# EAGLE design Cheer_Dev_Kit (EAGLE 9.4.2)
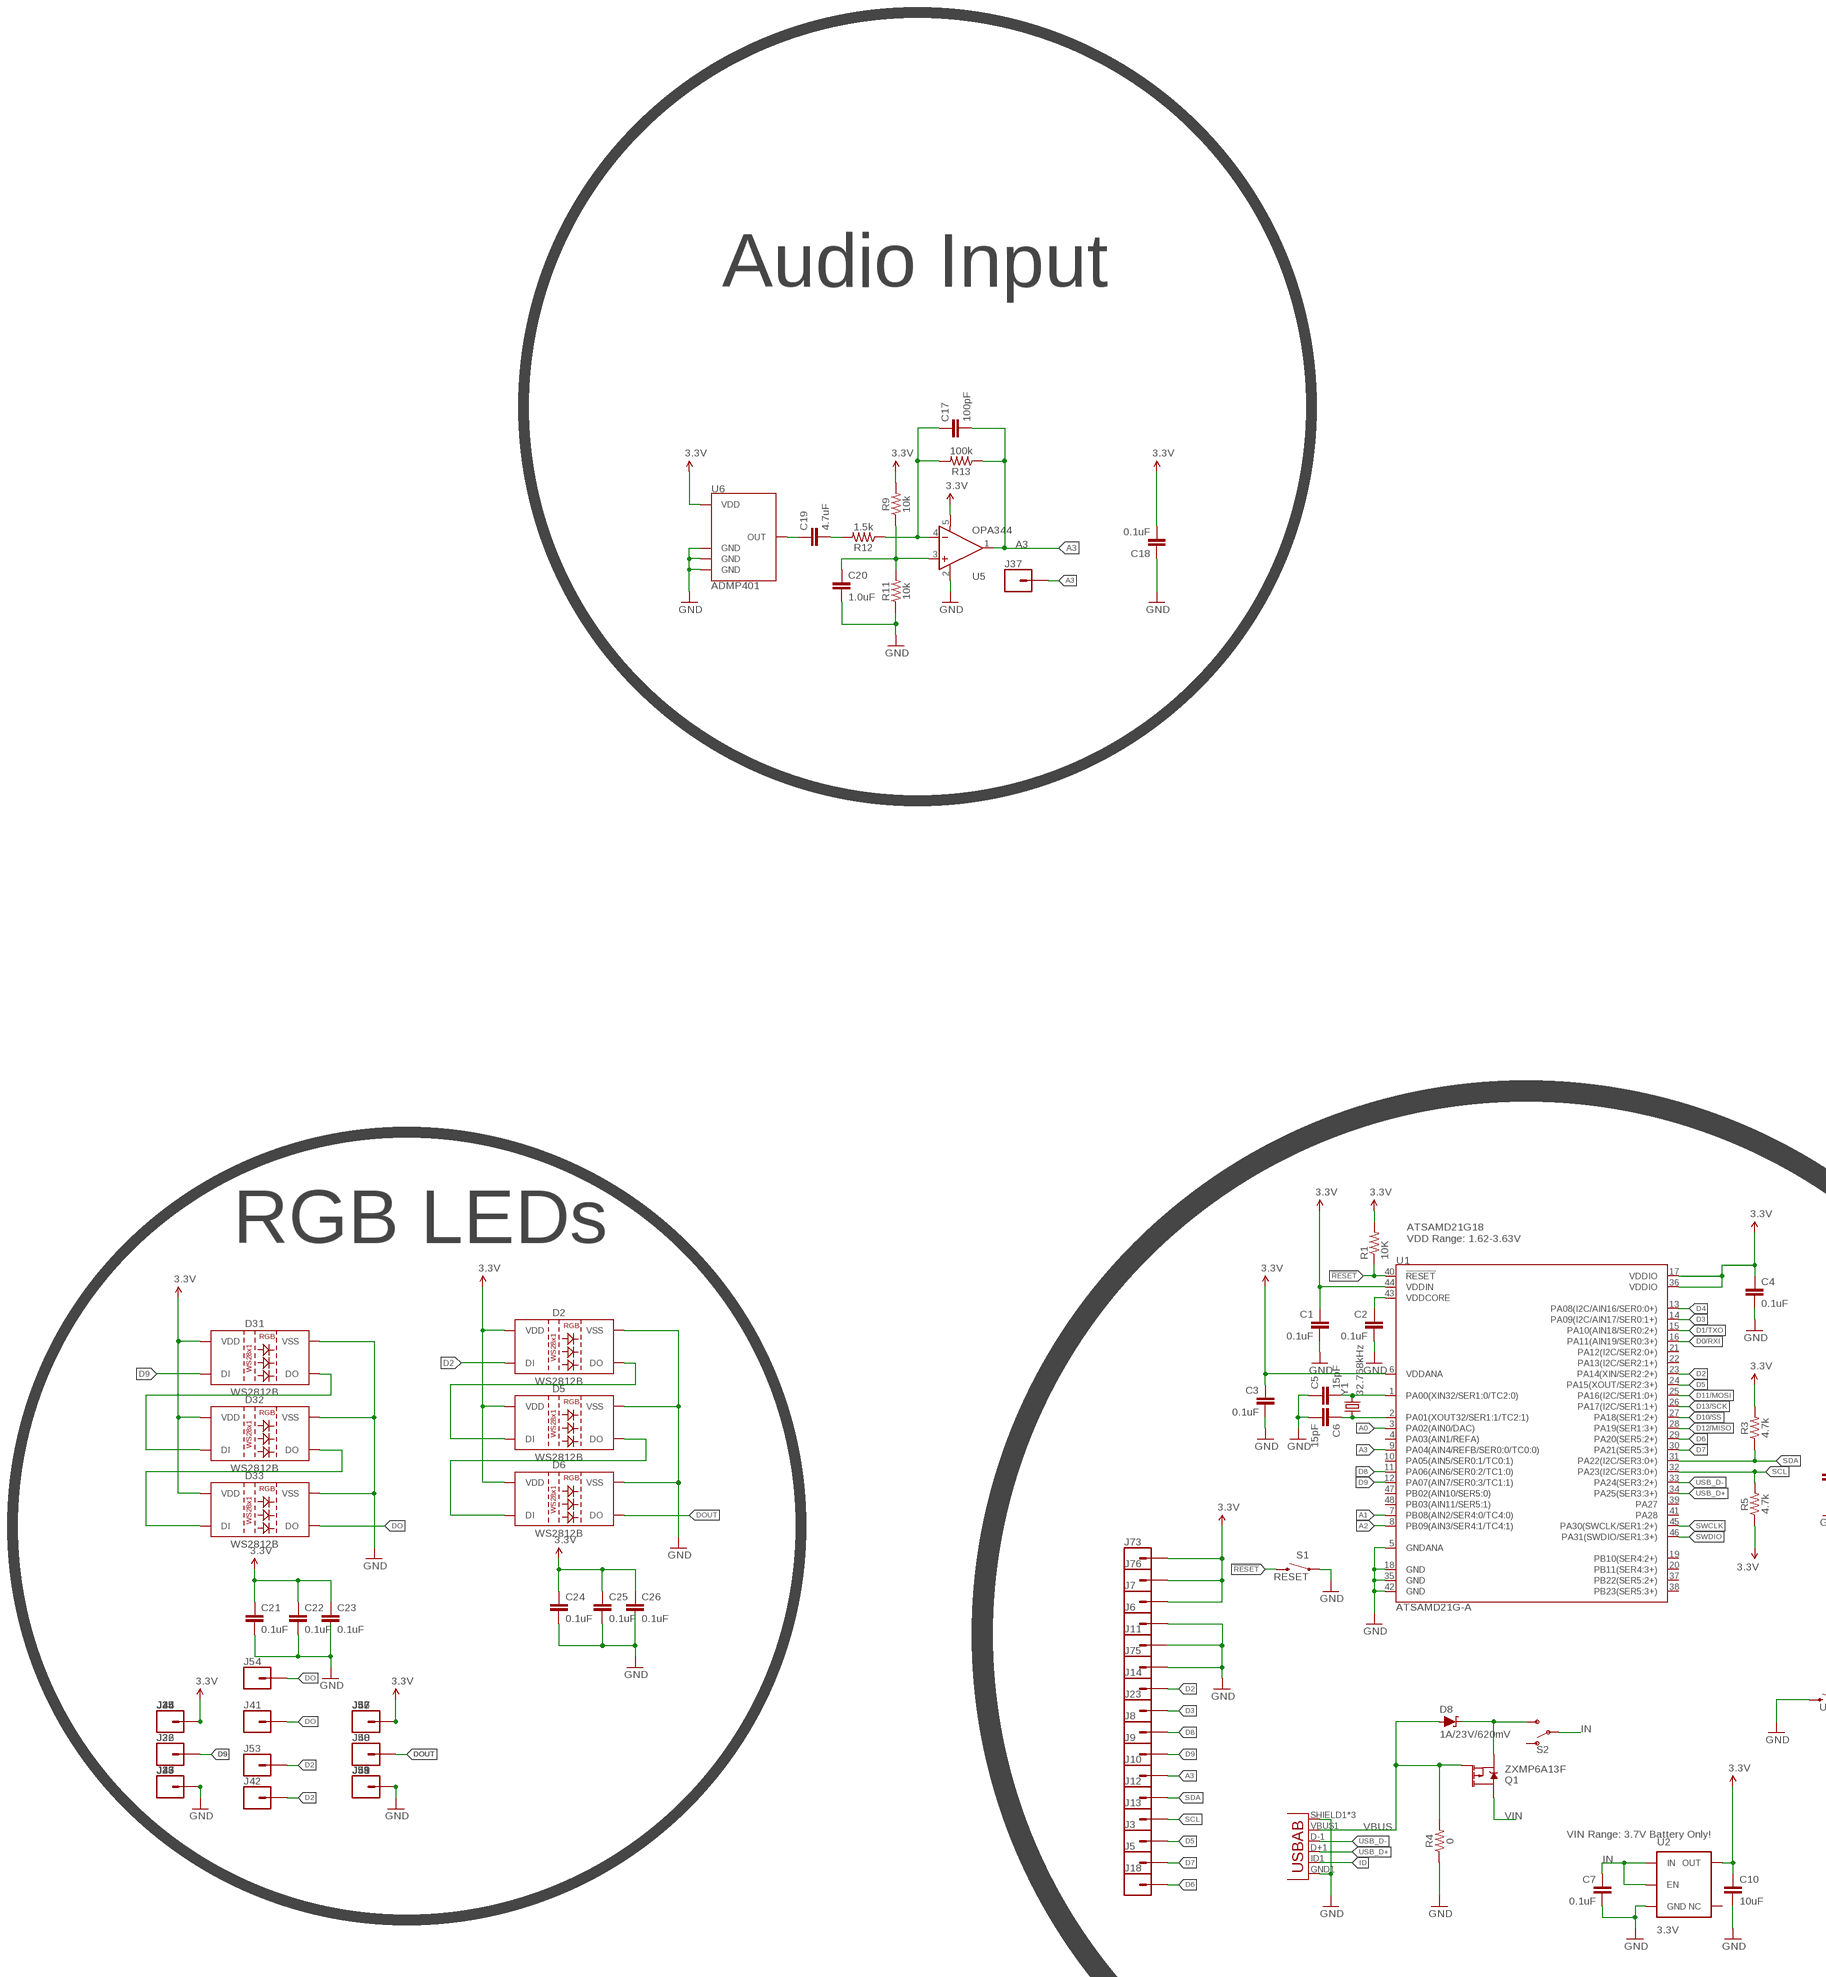
[diagram p0: schematic, sheet 1, part 1 of 3]
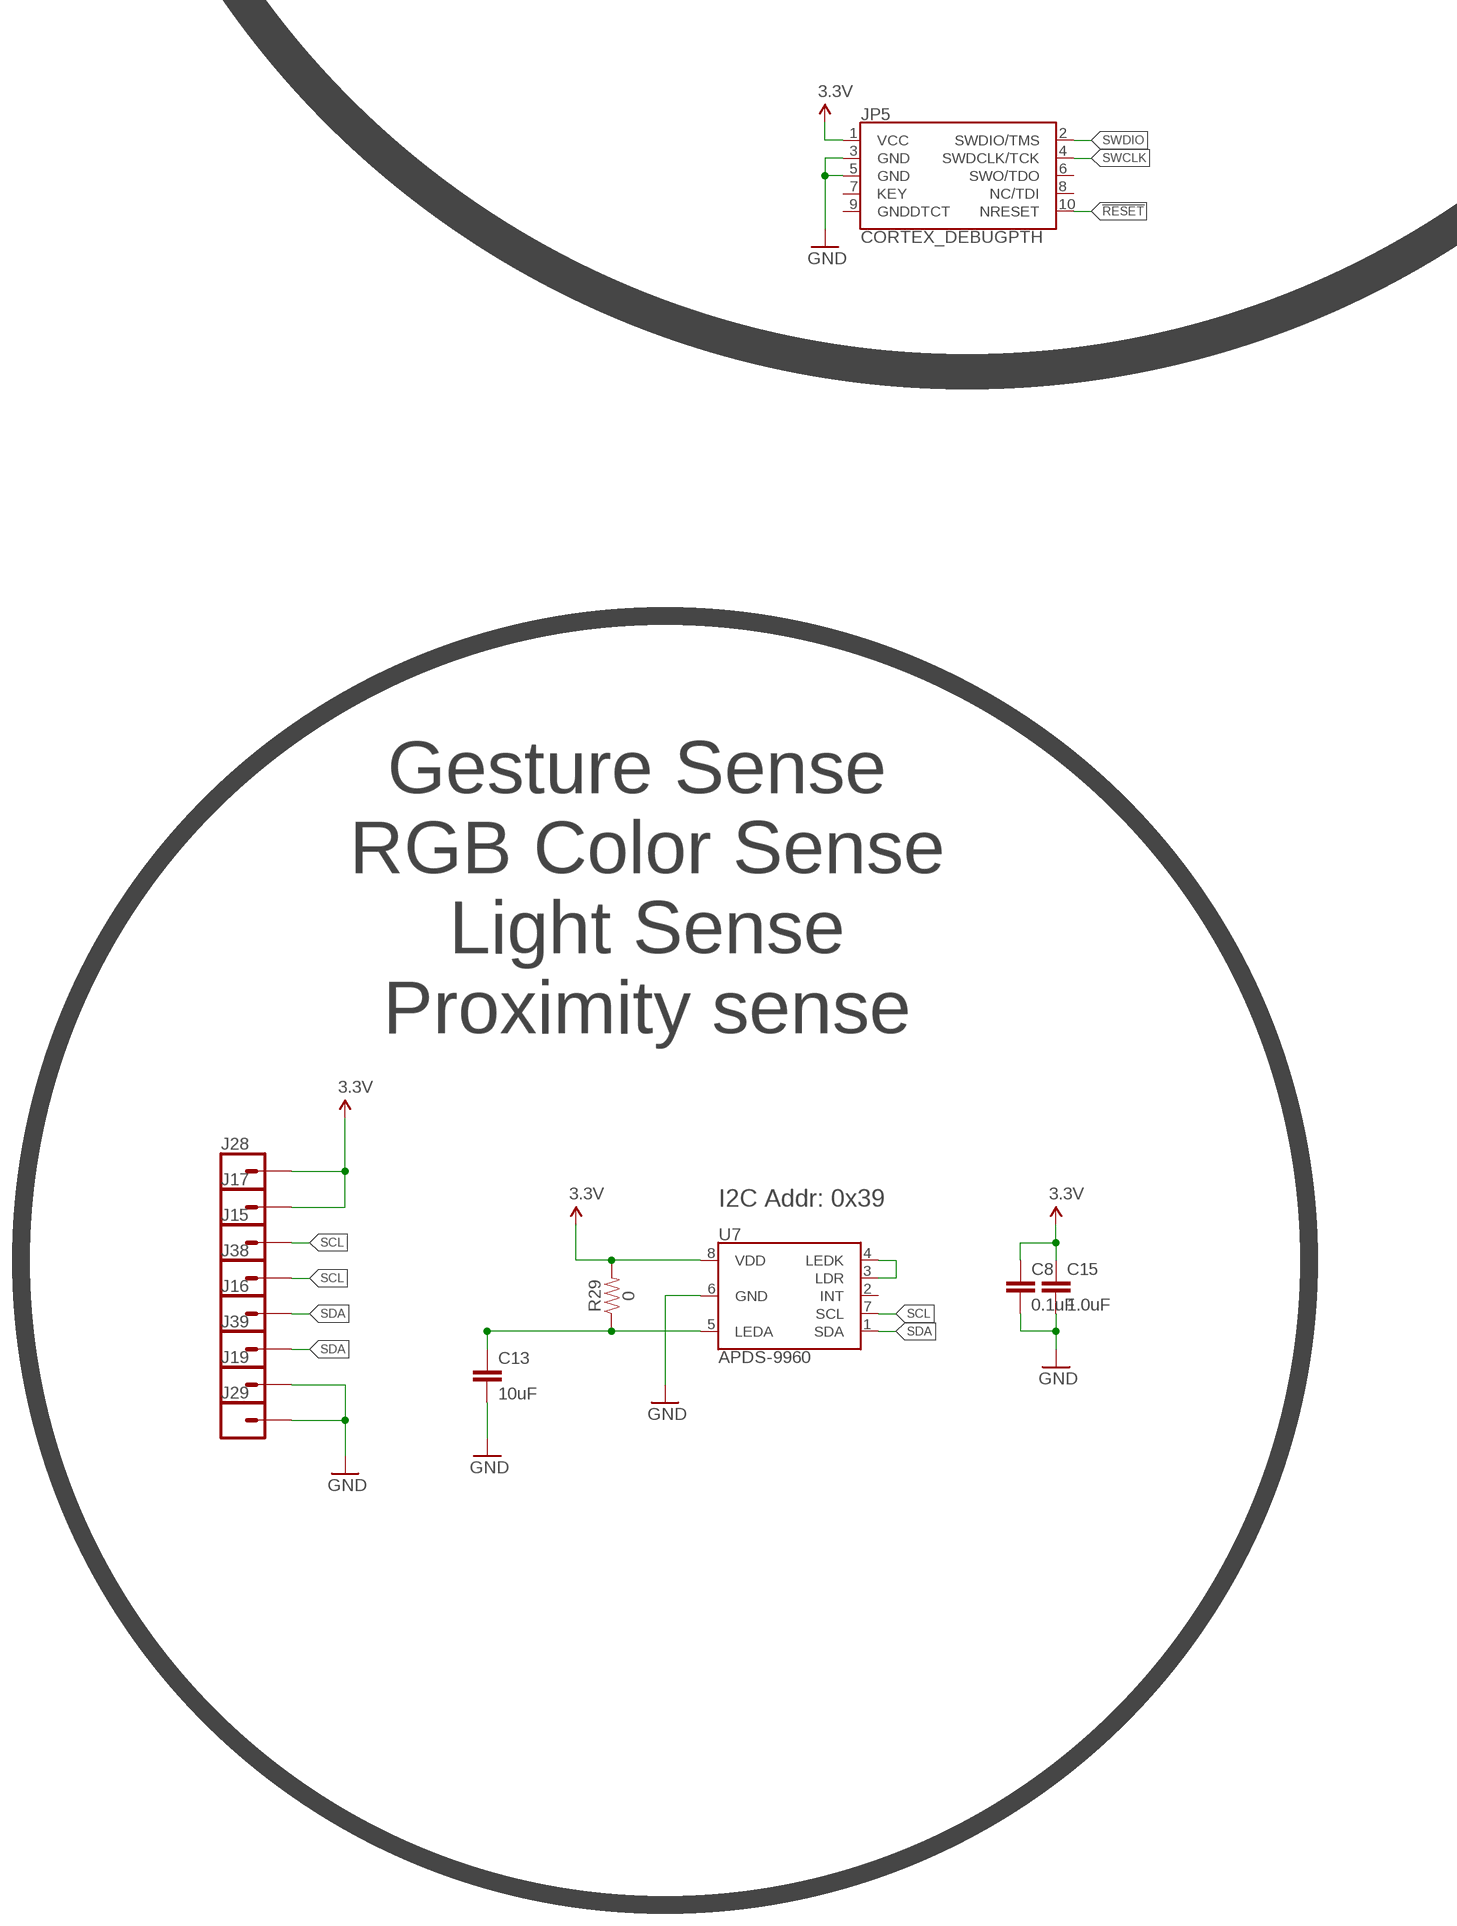
[diagram p1: schematic, sheet 1, part 2 of 3]
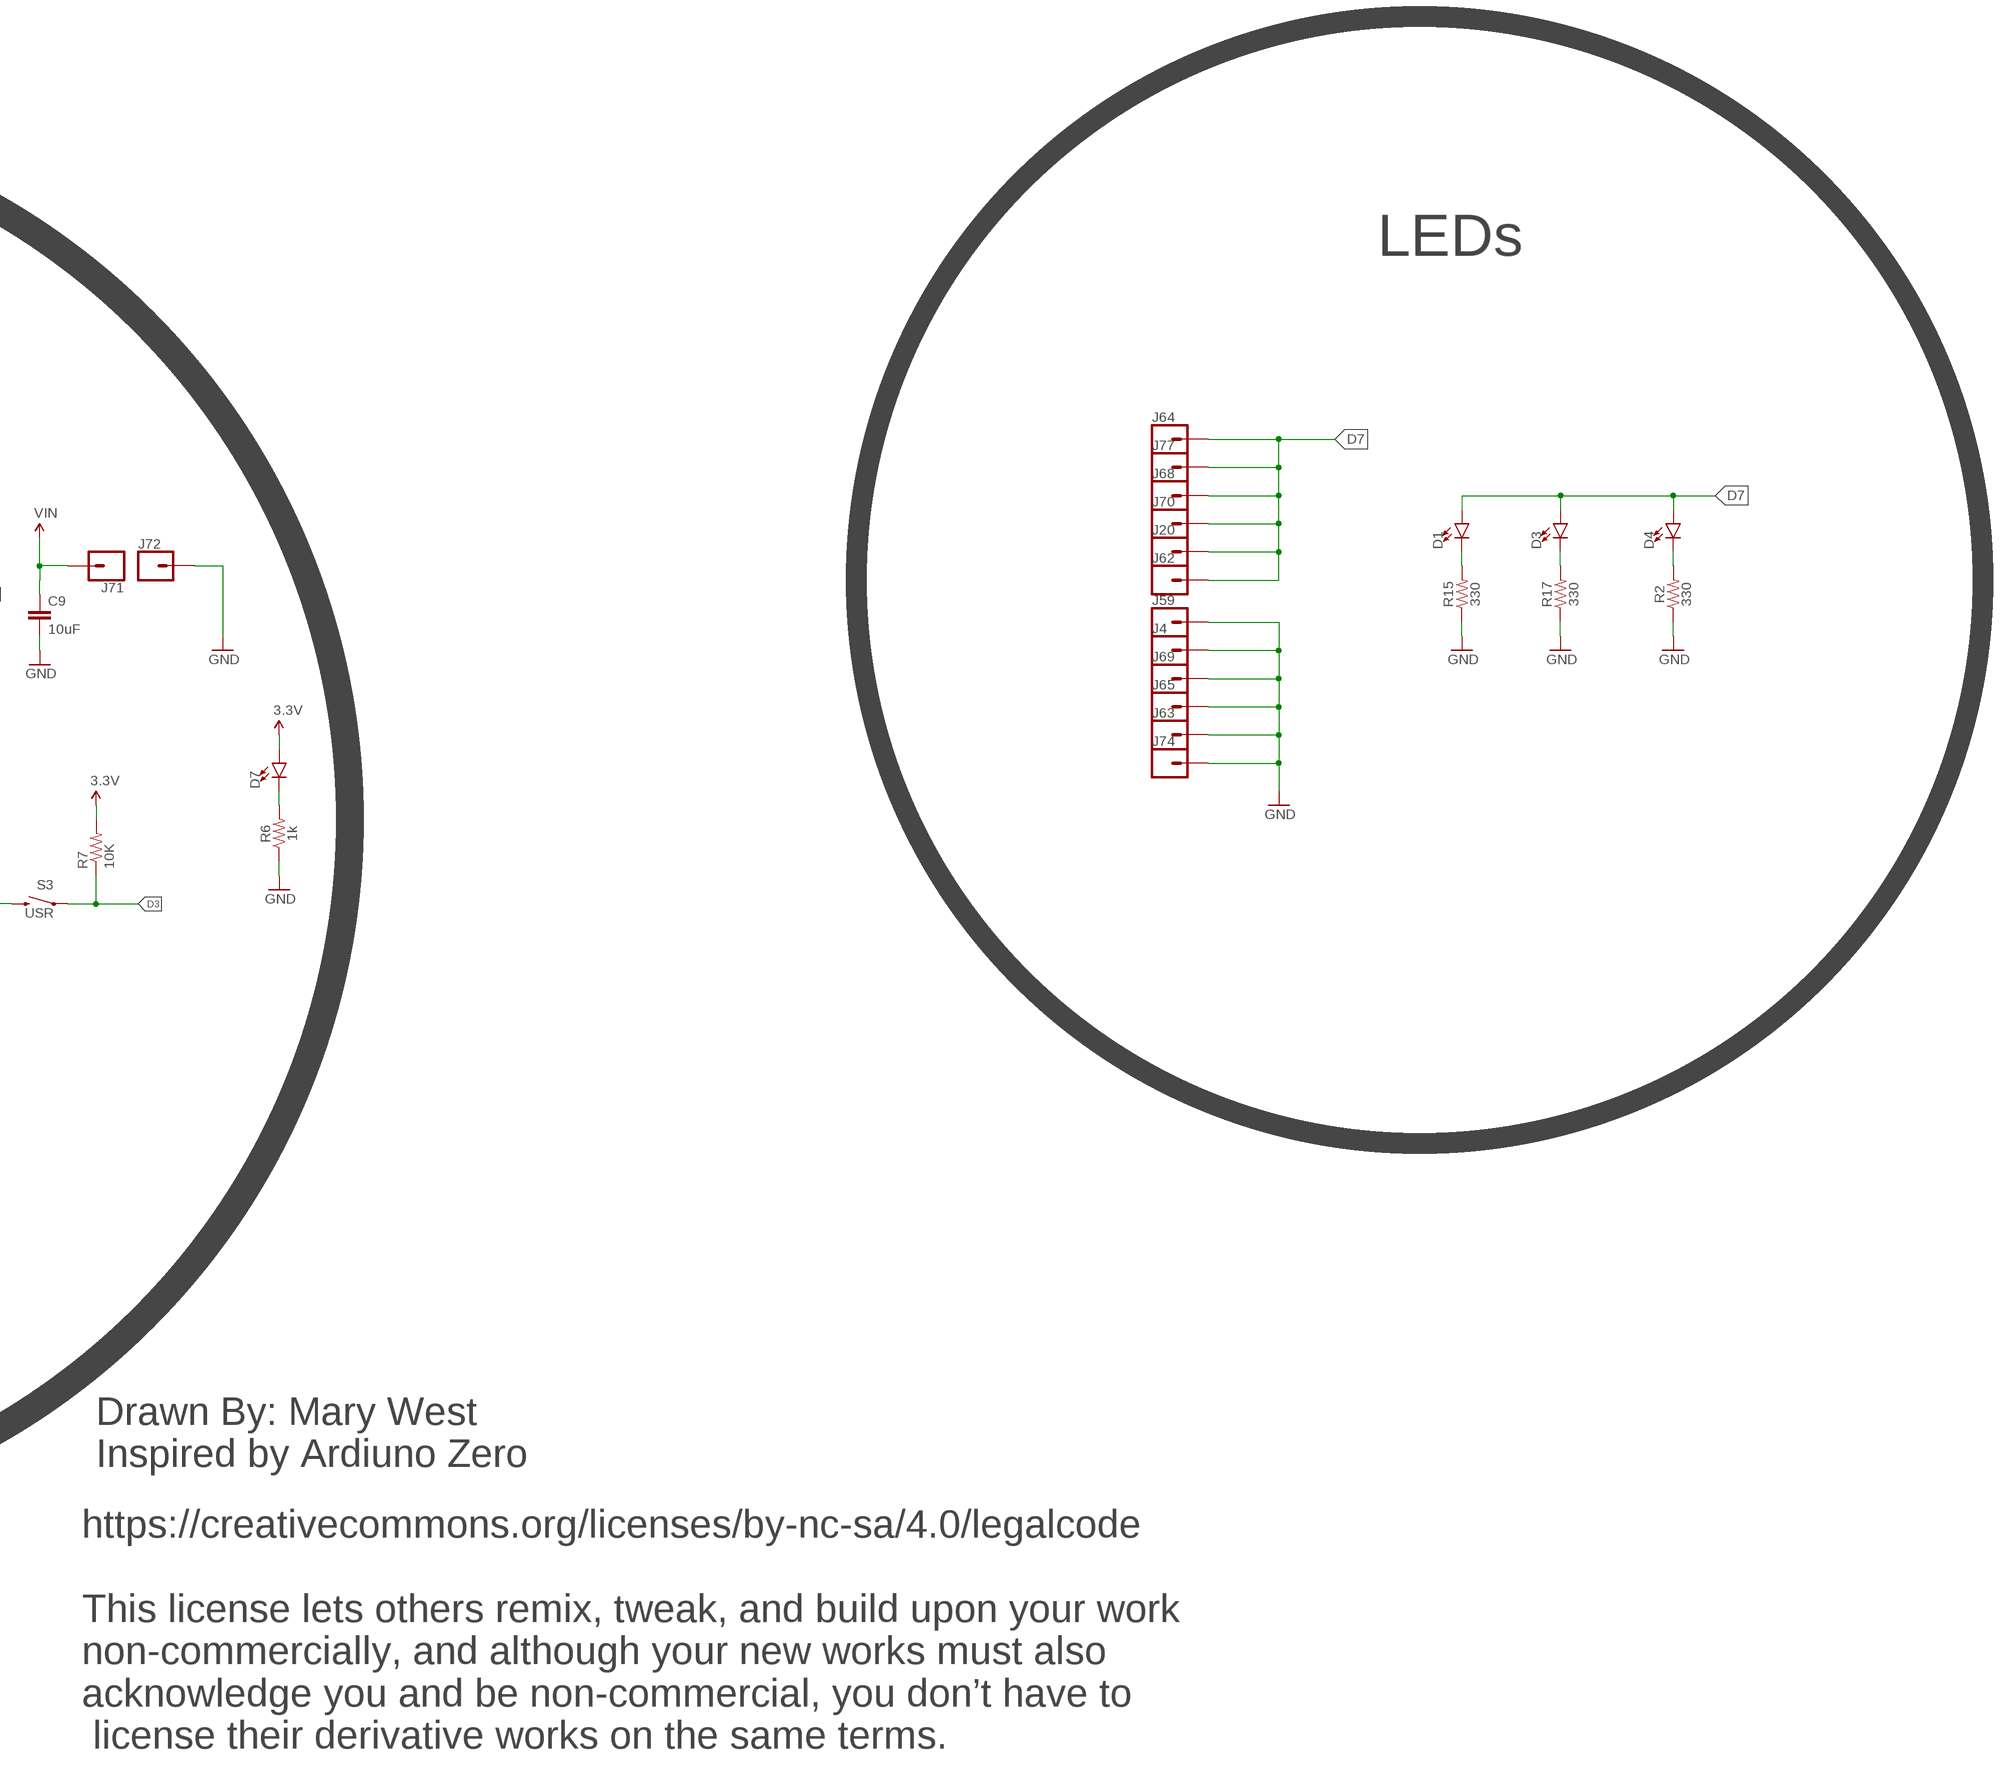
[diagram p2: schematic, sheet 1, part 3 of 3]

## Parts
C1  0.1uF  0.1UF-0603-25V-(+80/-20%)  [0603]
C2  0.1uF  0.1UF-0603-25V-(+80/-20%)  [0603]
C3  0.1uF  0.1UF-0603-25V-(+80/-20%)  [0603]
C4  0.1uF  0.1UF-0603-25V-(+80/-20%)  [0603]
C5  15pF  15PF-0603-50V-5%  [0603]
C6  15pF  15PF-0603-50V-5%  [0603]
C7  0.1uF  0.1UF-0603-25V-(+80/-20%)  [0603]
C8  0.1uF  0.1UF-0603-25V-(+80/-20%)  [0603]
C9  10uF  10UF-0603-6.3V-20%  [0603]
C10  10uF  10UF-0603-6.3V-20%  [0603]
C13  10uF  10UF-0805-10V-10%  [0805]
C15  1.0uF  1.0UF-0603-16V-10%  [0603]
C17  100pF  100PF-0603-50V-5%  [0603]
C18  0.1uF  0.1UF-0603-25V-(+80/-20%)  [0603]
C19  4.7uF  4.7UF-0603-6.3V-(10%)  [0603]
C20  1.0uF  1.0UF-0603-16V-10%  [0603]
C21  0.1uF  0.1UF-0603-25V-(+80/-20%)  [0603]
C22  0.1uF  0.1UF-0603-25V-(+80/-20%)  [0603]
C23  0.1uF  0.1UF-0603-25V-(+80/-20%)  [0603]
C24  0.1uF  0.1UF-0603-25V-(+80/-20%)  [0603]
C25  0.1uF  0.1UF-0603-25V-(+80/-20%)  [0603]
C26  0.1uF  0.1UF-0603-25V-(+80/-20%)  [0603]
D1  LED1206  [LED-1206]
D2  WS2812B  [WS2812B]
D3  LED1206  [LED-1206]
D4  LED1206  [LED-1206]
D5  WS2812B  [WS2812B]
D6  WS2812B  [WS2812B]
D7  LED1206  [LED-1206]
D8  1A/23V/620mV  DIODE-SCHOTTKY-BAT20J  [SOD-323]
D31  WS2812B  [WS2812B]
D32  WS2812B  [WS2812B]
D33  WS2812B  [WS2812B]
J3  CONN_01  [1X01]
J4  CONN_01  [1X01]
J5  CONN_01  [1X01]
J6  CONN_01  [1X01]
J7  CONN_01  [1X01]
J8  CONN_01  [1X01]
J9  CONN_01  [1X01]
J10  CONN_01  [1X01]
J11  CONN_01  [1X01]
J12  CONN_01  [1X01]
J13  CONN_01  [1X01]
J14  CONN_01  [1X01]
J15  CONN_01  [1X01]
J16  CONN_01  [1X01]
J17  CONN_01  [1X01]
J18  CONN_01  [1X01]
J19  CONN_01  [1X01]
J20  CONN_01  [1X01]
J23  CONN_01  [1X01]
J25  CONN_01  [1X01]
J26  CONN_01  [1X01]
J27  CONN_01  [1X01]
J28  CONN_01  [1X01]
J29  CONN_01  [1X01]
J32  CONN_01  [1X01]
J33  CONN_01  [1X01]
J34  CONN_01  [1X01]
J37  CONN_01  [1X01]
J38  CONN_01  [1X01]
J39  CONN_01  [1X01]
J41  CONN_01  [1X01]
J42  CONN_01  [1X01]
J43  CONN_01  [1X01]
J44  CONN_01  [1X01]
J45  CONN_01  [1X01]
J46  CONN_01  [1X01]
J47  CONN_01  [1X01]
J48  CONN_01  [1X01]
J49  CONN_01  [1X01]
J50  CONN_01  [1X01]
J51  CONN_01  [1X01]
J52  CONN_01  [1X01]
J53  CONN_01  [1X01]
J54  CONN_01  [1X01]
J55  CONN_01  [1X01]
J56  CONN_01  [1X01]
J57  CONN_01  [1X01]
J58  CONN_01  [1X01]
J59  CONN_01  [1X01]
J62  CONN_01  [1X01]
J63  CONN_01  [1X01]
J64  CONN_01  [1X01]
J65  CONN_01  [1X01]
J68  CONN_01  [1X01]
J69  CONN_01  [1X01]
J70  CONN_01  [1X01]
J71  CONN_01  [1X01]
J72  CONN_01  [1X01]
J73  CONN_01  [1X01]
J74  CONN_01  [1X01]
J75  CONN_01  [1X01]
J76  CONN_01  [1X01]
J77  CONN_01  [1X01]
JP3  USB-ABCONN-11794  [USB-AB-MICRO-SMD_V03]
JP5  CORTEX_DEBUGPTH  [2X5-PTH-1.27MM]
Q1  ZXMP6A13F  MOSFET_PCH-SI2309DS  [SOT23-3]
R1  10K  10KOHM-1/10W-1%(0603)0603  [0603-RES@1]
R2  330  330OHM-0603-1/10W-1%  [0603]
R3  4.7k  4.7KOHM-0603-1/10W-1%  [0603]
R4  0  0OHM-0603-1/10W-5%  [0603]
R5  4.7k  4.7KOHM-0603-1/10W-1%  [0603]
R6  1k  330OHM-0603-1/10W-1%  [0603]
R7  10K  10KOHM-1/10W-1%(0603)0603  [0603-RES@1]
R9  10k  10KOHM-0603-1/10W-1%  [0603]
R11  10k  10KOHM-0603-1/10W-1%  [0603]
R12  1.5k  1.5KOHM-0603-1/10W-1%  [0603]
R13  100k  100KOHM-0603-1/10W-1%  [0603]
R15  330  330OHM-0603-1/10W-1%  [0603]
R17  330  330OHM-0603-1/10W-1%  [0603]
R29  0  0OHM-0603-1/10W-5%  [0603]
S1  RESET  SWITCH-MOMENTARY-2SMD-4.6X2.8MM  [TACTILE_SWITCH_SMD_4.6X2.8MM]
S2  SWITCH-SPDT-SMD-AYZ0202  [SWITCH_DPDT_SMD_AYZ0202]
S3  USR  SWITCH-MOMENTARY-2SMD-4.6X2.8MM  [TACTILE_SWITCH_SMD_4.6X2.8MM]
U1  ATSAMD21G-A  [TQFP-48]
U2  3.3V  V_REG_AP2112K-3.3V  [SOT23-5]
U5  OPA344  [SOT23-5]
U6  ADMP401  [ADMP401]
U7  APDS-9960  [APDS-9960]
Y1  32.768kHz  CRYSTAL3.2X1.5MM  [CRYSTAL-SMD-3.2X1.5MM]

## Nets
3.3V: C1.1 C3.1 C4.1 C8.1 C10.1 C15.1 C18.2 C21.1 C22.1 C23.1 C24.1 C25.1 C26.1 D2.1(VDD) D5.1(VDD) D6.1(VDD) D7.A D31.1(VDD) D32.1(VDD) D33.1(VDD) J7.P$1 J17.P$1 J25.P$1 J28.P$1 J34.P$1 J44.P$1 J45.P$1 J47.P$1 J52.P$1 J56.P$1 J57.P$1 J73.P$1 J76.P$1 JP5.1(VCC) R1.2 R3.2 R5.1 R7.2 R9.2 R29.2 U1.6(VDDANA) U1.17(VDDIO) U1.36(VDDIO) U1.44(VDDIN) U2.5(OUT) U5.5(V+) U6.5(VDD) U7.8(VDD)
!RESET: JP5.10(NRESET) R1.1 S1.3 S1.4 U1.40(!RESET!)
A0: U1.3(PA02(AIN0/DAC))
A1: U1.7(PB08(AIN2/SER4:0/TC4:0))
A2: U1.8(PB09(AIN3/SER4:1/TC4:1))
A3: C17.2 J10.P$1 J37.P$1 R13.1 U1.9(PA04(AIN4/REFB/SER0:0/TC0:0)) U5.1(OUT)
D0/RXI: U1.16(PA11(AIN19/SER0:3+))
D1/TXO: U1.15(PA10(AIN18/SER0:2+))
D2: D2.4(DI) J14.P$1 J42.P$1 J53.P$1 U1.23(PA14(XIN/SER2:2+))
D3: J23.P$1 R7.1 S3.1 S3.2 U1.14(PA09(I2C/AIN17/SER0:1+))
D4: U1.13(PA08(I2C/AIN16/SER0:0+))
D5: J3.P$1 U1.24(PA15(XOUT/SER2:3+))
D6: J18.P$1 U1.29(PA20(SER5:2+))
D7: D1.A D3.A D4.A J5.P$1 J20.P$1 J62.P$1 J64.P$1 J68.P$1 J70.P$1 J77.P$1 U1.30(PA21(SER5:3+))
D8: J8.P$1 U1.11(PA06(AIN6/SER0:2/TC1:0))
D9: D31.4(DI) J9.P$1 J26.P$1 J32.P$1 U1.12(PA07(AIN7/SER0:3/TC1:1))
D10/SS: U1.27(PA18(SER1:2+))
D11/MOSI: U1.25(PA16(I2C/SER1:0+))
D12/MISO: U1.28(PA19(SER1:3+))
D13/SCK: U1.26(PA17(I2C/SER1:1+))
DO: D33.2(DO) J41.P$1 J54.P$1
DOUT: D6.2(DO) J48.P$1 J50.P$1
GND: C1.2 C2.2 C3.2 C4.2 C5.1 C6.2 C7.2 C8.2 C9.2 C10.2 C13.2 C15.2 C18.1 C20.2 C21.2 C22.2 C23.2 C24.2 C25.2 C26.2 D2.3(VSS) D5.3(VSS) D6.3(VSS) D31.3(VSS) D32.3(VSS) D33.3(VSS) J4.P$1 J6.P$1 J11.P$1 J19.P$1 J27.P$1 J29.P$1 J33.P$1 J43.P$1 J46.P$1 J49.P$1 J51.P$1 J55.P$1 J58.P$1 J59.P$1 J63.P$1 J65.P$1 J69.P$1 J72.P$1 J74.P$1 J75.P$1 JP3.GND1(GND) JP3.SHIELD1(SHIELD) JP3.SHIELD2(SHIELD) JP3.SHIELD3(SHIELD) JP5.3(GND) JP5.5(GND) R2.1 R4.1 R6.1 R11.1 R15.1 R17.1 S1.1 S1.2 S3.3 S3.4 U1.5(GNDANA) U1.18(GND) U1.35(GND) U1.42(GND) U2.2(GND) U5.2(V-) U6.2(GND) U6.4(GND) U6.6(GND) U7.6(GND)
ID: JP3.ID1(USBID)
IN: C7.1 S2.2(P) U2.1(IN) U2.3(EN)
LEDA: C13.1 R29.1 U7.5(LEDA)
N$1: D4.C R2.2
N$2: C5.2 U1.1(PA00(XIN32/SER1:0/TC2:0)) Y1.P$2
N$3: C19.1 U6.1(OUT)
N$4: C6.1 U1.2(PA01(XOUT32/SER1:1/TC2:1)) Y1.P$1
N$5: U7.3(LDR) U7.4(LEDK)
N$6: C17.1 R12.1 R13.2 U5.4(-IN)
N$7: D7.C R6.2
N$8: D8.C Q1.2(S) S2.3(S)
N$10: C19.2 R12.2
N$11: C20.1 R9.1 R11.2 U5.3(+IN)
N$12: D1.C R15.2
N$14: D31.2(DO) D32.4(DI)
N$15: D3.C R17.2
N$16: D32.2(DO) D33.4(DI)
N$22: D2.2(DO) D5.4(DI)
N$23: D5.2(DO) D6.4(DI)
SCL: J13.P$1 J15.P$1 J38.P$1 R5.2 U1.32(PA23(I2C/SER3:0+)) U7.7(SCL)
SDA: J12.P$1 J16.P$1 J39.P$1 R3.1 U1.31(PA22(I2C/SER3:0+)) U7.1(SDA)
SWCLK: JP5.4(SWDCLK/TCK) U1.45(PA30(SWCLK/SER1:2+))
SWDIO: JP5.2(SWDIO/TMS) U1.46(PA31(SWDIO/SER1:3+))
USB_D+: JP3.D+1(D+) U1.34(PA25(SER3:3+))
USB_D-: JP3.D-1(D-) U1.33(PA24(SER3:2+))
VBUS: D8.A JP3.VBUS1(VBUS) Q1.1(G) R4.2
VDDCORE: C2.1 U1.43(VDDCORE)
VIN: C9.1 J71.P$1 Q1.3(D)
Unconnected: JP5.6(SWO/TDO) JP5.7(KEY) JP5.8(NC/TDI) JP5.9(GNDDTCT) S2.1(O) U1.4(PA03(AIN1/REFA)) U1.10(PA05(AIN5/SER0:1/TC0:1)) U1.19(PB10(SER4:2+)) U1.20(PB11(SER4:3+)) U1.21(PA12(I2C/SER2:0+)) U1.22(PA13(I2C/SER2:1+)) U1.37(PB22(SER5:2+)) U1.38(PB23(SER5:3+)) U1.39(PA27) U1.41(PA28) U1.47(PB02(AIN10/SER5:0)) U1.48(PB03(AIN11/SER5:1)) U2.4(NC) U7.2(INT)

## Notes on the sheet
- Audio Input
- LEDs
- ATSAMD21G18
  VDD Range: 1.62-3.63V
- RGB LEDs
- VIN Range: 3.7V Battery Only!
- Drawn By: Mary West 
  Inspired by Ardiuno Zero
- https://creativecommons.org/licenses/by-nc-sa/4.0/legalcode
  
  This license lets others remix, tweak, and build upon your work
  non-commercially, and although your new works must also 
  acknowledge you and be non-commercial, you don’t have to
   license their derivative works on the same terms.
- Gesture Sense 
  RGB Color Sense
  Light Sense
  Proximity sense
- I2C Addr: 0x39

## Library data of the parts
C1-C4 C7 C8 C18 C21-C26 = SparkFun-Capacitors:0.1UF: 0.1µF ceramic capacitors A capacitor is a passive two-terminal electrical component used to store electrical energy temporarily in an electric field.; PROD_ID: CAP-00810
C5 C6 = SparkFun-Capacitors:15PF: 15pF ceramic capacitors A capacitor is a passive two-terminal electrical component used to store electrical energy temporarily in an electric field.; PROD_ID: CAP-07881
C9 C10 = SparkFun-Capacitors:10UF: 10.0µF ceramic capacitors A capacitor is a passive two-terminal electrical component used to store electrical energy temporarily in an electric field.; PROD_ID: CAP-11015
C13 = SparkFun-Capacitors:10UF: 10.0µF ceramic capacitors A capacitor is a passive two-terminal electrical component used to store electrical energy temporarily in an electric field.; PROD_ID: CAP-11330
C15 C20 = SparkFun-Capacitors:1.0UF: 1µF ceramic capacitors A capacitor is a passive two-terminal electrical component used to store electrical energy temporarily in an electric field.; PROD_ID: CAP-00868
C17 = SparkFun-Capacitors:100PF: 100pF/0.1nF ceramic capacitors A capacitor is a passive two-terminal electrical component used to store electrical energy temporarily in an electric field.; PROD_ID: CAP-07883
C19 = SparkFun-Capacitors:4.7UF: 4.7µF ceramic capacitors A capacitor is a passive two-terminal electrical component used to store electrical energy temporarily in an electric field.; PROD_ID: CAP-08280
D1 D3 D4 D7 = SparkFun-LED:LED: LED (Generic) Standard schematic elements and footprints for 5mm, 3mm, 1206, and 0603 sized LEDs. Generic LEDs with no color specified.
D2 D5 D6 D31-D33 = SparkFun-LED:WS2812B: WS2812B SMD addressable RGB LED 5x5mm SMD LED with built-in controller IC. Color: Red/Green/Blue mC Rating: RGB: 390, 660, 180 mcd Forward Voltage: RGB: 2.0, 3.0, 3.0 V Packages:WS2812B SparkFun Products: Blynk Board - ESP8266 <https://www.sparkfun.com/products/13794>; PROD_ID: DIO-12503
D8 = SparkFun-DiscreteSemi:DIODE-SCHOTTKY: Schottky diode A Schottky diode is a semiconductor diode which has a low forward voltage drop and a very fast switching action.; PROD_ID: DIO-11623
J3-J20 J23 J25-J29 J32-J34 J37-J39 J41-J59 J62-J65 J68-J77 = SparkFun-Connectors:CONN_01: Single connection point. Often used as Generic Header-pin footprint for 0.1 inch spaced/style header connections On any of the 0.1 inch spaced packages, you can populate with these: Break Away Headers - Straight (PRT-00116) Break Away Male Headers - Right Angle (PRT-00553) Female Headers (PRT-00115) Break Away Headers - Machine Pin (PRT-00117) Break Away Female Headers - Swiss Machine Pin (PRT-00743) This device is also useful as a general connection point to wire up your design to another part of your project. Our various solder wires solder well into these plated through hole pads. Hook-Up Wire - Assortment (Stranded, 22 AWG) (PRT-11375) Hook-Up Wire - Assortment (Solid Core, 22 AWG) (PRT-11367) View the entire wire category on our website here Special notes: SMTSO-256-ET is a "flush mount" nut for a 4-40 screw. We mostly use this on specialty testbeds; it is a nice way to connect hardware to your PCB at an adjustable hieght. Also note, the SNAP packages are for using a snappable style connector. We sell a baggie of snaps and they are also used on two LilyPad designs: Snap Assortment - 30 pack (male and female) (DEV-11347) LilyPad Arduino SimpleSnap (DEV-10941) LilyPad SimpleSnap Protoboard (DEV-10940)
JP3 = SparkFun-Connectors:USB-AB: This is a USB AB connector that is compatible with USB OTG. i.e. this connector can serve as a host or device; PROD_ID: CONN-11794
JP5 = samd21-temp:CORTEX_DEBUG: Cortex Debug Connector Datasheet
Q1 = SparkFun-DiscreteSemi:MOSFET_PCH: P-channel MOSFETs Voltage controlled devices that allow control of high current outputs. SparkFun Products: SparkFun ESP32 Thing <https://www.sparkfun.com/products/13907> SparkFun ESP8266 Thing <https://www.sparkfun.com/products/13231>; PROD_ID: TRANS-08285; VALUE: 1.1A/60V/600mΩ
R1 R7 = SparkFun-Resistors:10KOHM-1/10W-1%(0603): RES-00824; PROD_ID: RES-00824
R2 R15 R17 = SparkFun-Resistors:330OHM: 330Ω resistor A resistor is a passive two-terminal electrical component that implements electrical resistance as a circuit element. Resistors act to reduce current flow, and, at the same time, act to lower voltage levels within circuits. - Wikipedia; PROD_ID: RES-00818
R3 R5 = SparkFun-Resistors:4.7KOHM: 4.7kΩ resistor A resistor is a passive two-terminal electrical component that implements electrical resistance as a circuit element. Resistors act to reduce current flow, and, at the same time, act to lower voltage levels within circuits. - Wikipedia; PROD_ID: RES-07857
R4 R29 = SparkFun-Resistors:0OHM: 0Ω resistor A resistor is a passive two-terminal electrical component that implements electrical resistance as a circuit element. Resistors act to reduce current flow, and, at the same time, act to lower voltage levels within circuits. - Wikipedia; PROD_ID: RES-08609
R6 = SparkFun-Resistors:330OHM: 330Ω resistor A resistor is a passive two-terminal electrical component that implements electrical resistance as a circuit element. Resistors act to reduce current flow, and, at the same time, act to lower voltage levels within circuits. - Wikipedia; PROD_ID: RES-00818; VALUE: 330
R9 R11 = SparkFun-Resistors:10KOHM: 10kΩ resistor A resistor is a passive two-terminal electrical component that implements electrical resistance as a circuit element. Resistors act to reduce current flow, and, at the same time, act to lower voltage levels within circuits. - Wikipedia; PROD_ID: RES-00824
R12 = SparkFun-Resistors:1.5KOHM: 1.5kΩ resistor A resistor is a passive two-terminal electrical component that implements electrical resistance as a circuit element. Resistors act to reduce current flow, and, at the same time, act to lower voltage levels within circuits. - Wikipedia; PROD_ID: RES-08306
R13 = SparkFun-Resistors:100KOHM: 100kΩ resistor A resistor is a passive two-terminal electrical component that implements electrical resistance as a circuit element. Resistors act to reduce current flow, and, at the same time, act to lower voltage levels within circuits. - Wikipedia; PROD_ID: RES-07828
S1 S3 = samd21-temp:SWITCH-MOMENTARY-2: Various NO switches- pushbuttons, reed, etc; PROD_ID: SWCH-13065
S2 = SparkFun-Switches:SWITCH-SPDT: Single Pole, Double Throw (SPDT) Switch Single-pole, double-throw (SPDT) switch. Variant Overview SMD-AYZ0202 Surface Mount DPDT Switch (COM-00597) Used on e.g. LilyPad Arduino USB - ATmega32U4 Board PTH-11.6X4.0MM SPDT Mini Power Switch (COM-00102) Used on e.g. SparkFun Simon Says - Through-Hole Soldering Kit (KIT-10547) PTH-11.6X4.0MM-KIT KIT version of SPDT Mini Power Switch - Simplifies soldering by removing tStop of switch pins - only one side can be soldered. PTH-11.6X4.0MM-LOCK LOCK version of SPDT Mini Power Switch - Offset pins hold switch in place for easier soldering. SMD-RIGHT-ANGLE Surface Mount Right Angle Switch (COM-10860) Used on e.g. SparkFun ESP8266 Thing; PROD_ID: SWCH-08179; SF_ID: COM-00597
U1 = samd21-temp:ATSAMD21G: Atmel SAMD21G SMART ARM-Based Microcontroller The Atmel ® | SMART ™ SAM D21 is a series of low-power microcontrollers using the 32-bit ARM ® Cortex ® -M0+ processor, and ranging from 32- to 64-pins with up to 256KB Flash and 32KB of SRAM. The SAM D21 devices operate at a maximum frequency of 48MHz and reach 2.46 CoreMark/MHz. They are designed for simple and intuitive migration with identical peripheral modules, hex compatible code, identical linear address map and pin compatible migration paths between all devices in the product series. All devices include intelligent and flexible peripherals, Atmel Event System for inter-peripheral signaling, and support for capacitive touch button, slider and wheel user interfaces.; PROD_ID: IC-13064
U2 = SparkFun-PowerIC:V_REG_AP2112: AP2112 - 600mA CMOS LDO Regulator w/ Enable The AP2112 is CMOS process low dropout linear regulator with enable function, the regulator delivers a guaranteed 600mA (min.) continuous load current. Features Output Voltage Accuracy: ±1.5% Output Current: 600mA (Min.) Foldback Short Current Protection: 50mA Enable Function to Turn ON/OFF VOUT Low Dropout Voltage (3.3V): 250mV (Typ.) @IOUT=600mA Excellent Load Regulation: 0.2%/A (Typ.) Excellent Line Regulation: 0.02%/V (Typ.) Low Quiescent Current: 55μA (Typ.) Low Standby Current: 0.01μA (Typ.) Low Output Noise: 50μVRMS PSRR: 100Hz -65dB, 1kHz -65dB OTSD Protection Stable with 1.0μF Flexible Cap: Ceramic, Tantalum and Aluminum Electrolytic Operation Temperature Range: -40°C to 85°C ESD: MM 400V, HBM 4000V; PROD_ID: VREG-12457
U5 = SparkFun:OPA344
U6 = SparkFun-Sensors:ADMP401: ADMP401 - Omnidirection Bottom-Port MEMS Microphone The ADMP401 is a high quality, low cost, low power analog output bottom-ported omnidirectional MEMS microphone. The ADMP401 consists of a MEMS microphone element, an impedance converter, and an output amplifier. The ADMP401 sensitivity specification makes it an excellent choice for both near field and far field applications. Datasheet SparkFun Products SparkFun MEMS Microphone Breakout - INMP401 (ADMP401) (BOB-09868) MEMS Microphone - INMP401 (ADMP401) (COM-10028); PROD_ID: IC-09773
U7 = SparkFun-Sensors:APDS-9960: Avago APDS-9960 Digital Proximity, Ambient Light, RGB, and Gesture Sensor. The APDS-9960 offers ambient light and color measuring, proximity detection, and touchless gesture sensing. It features UV and IR blocking filters, four separate diodes sensitive to different directions, and an I2C compatible interface. Datasheet SparkFun Products SparkFun RGB and Gesture Sensor - APDS-9960 (SEN-12787); PROD_ID: SEN-12005
Y1 = samd21-temp:CRYSTAL: Various standard crystals. Proven footprints.; PROD_ID: XTAL-13062

## Board
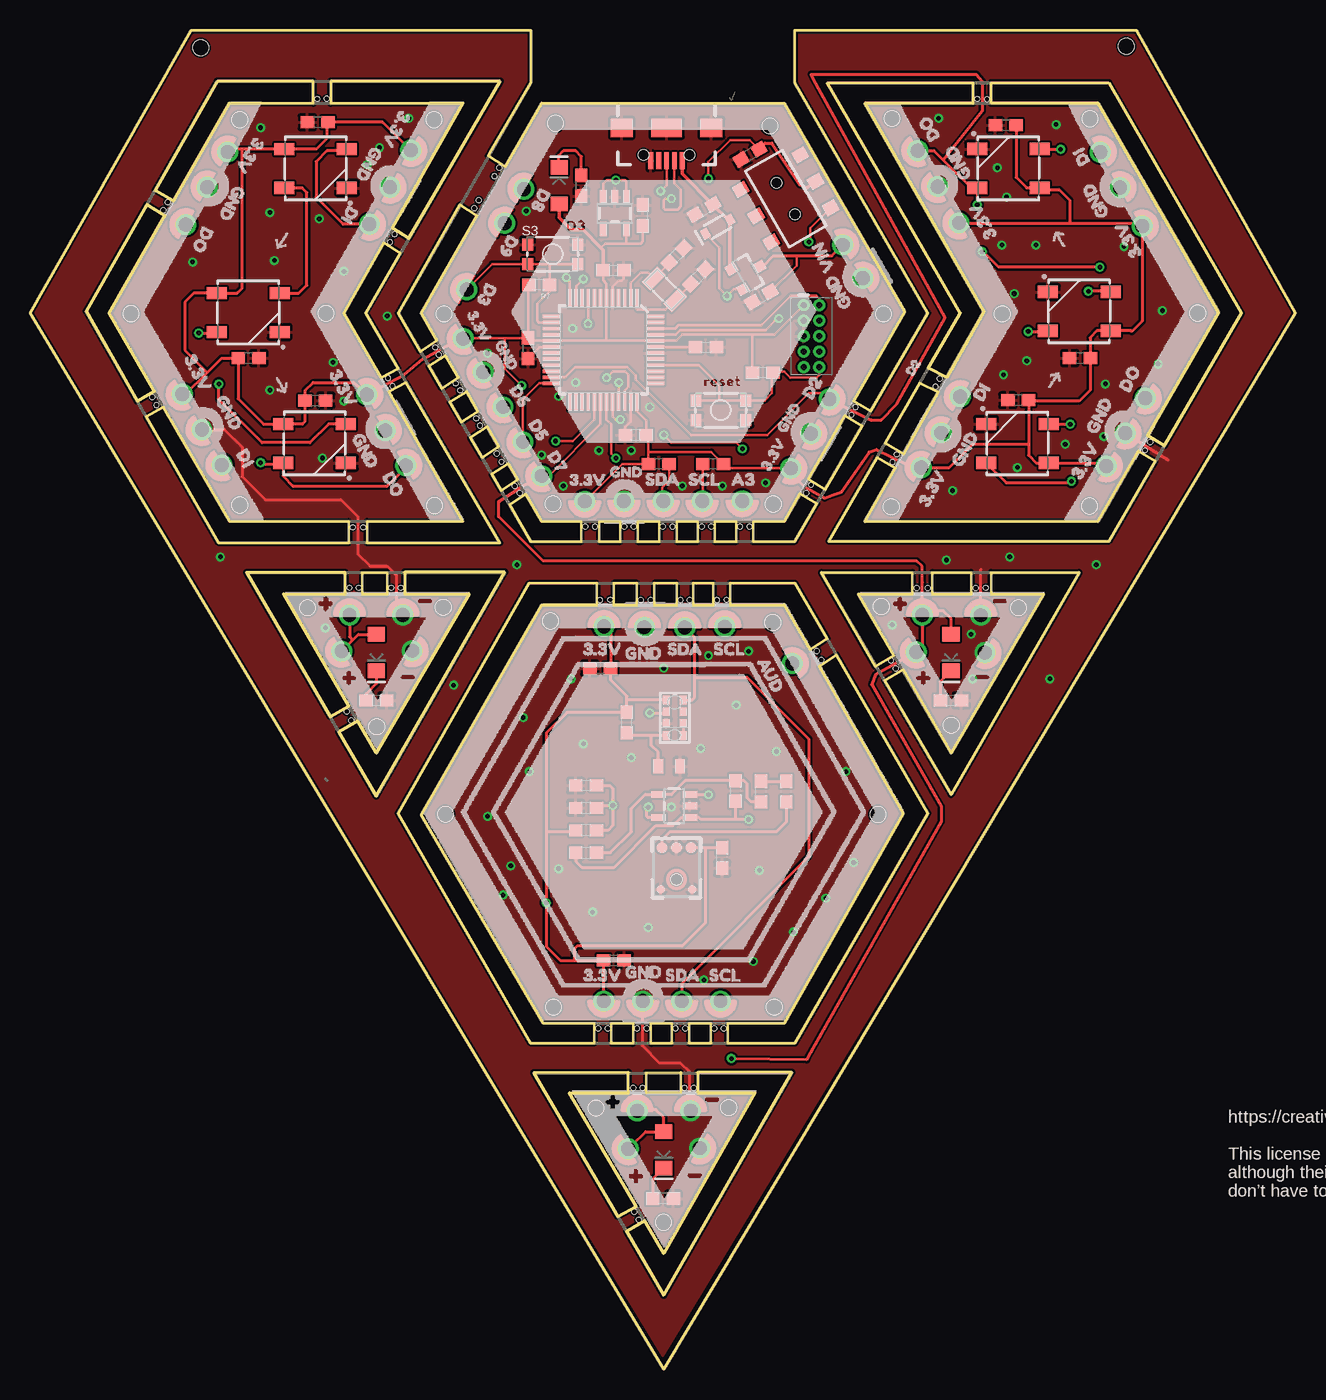
[diagram p3: board, top side]
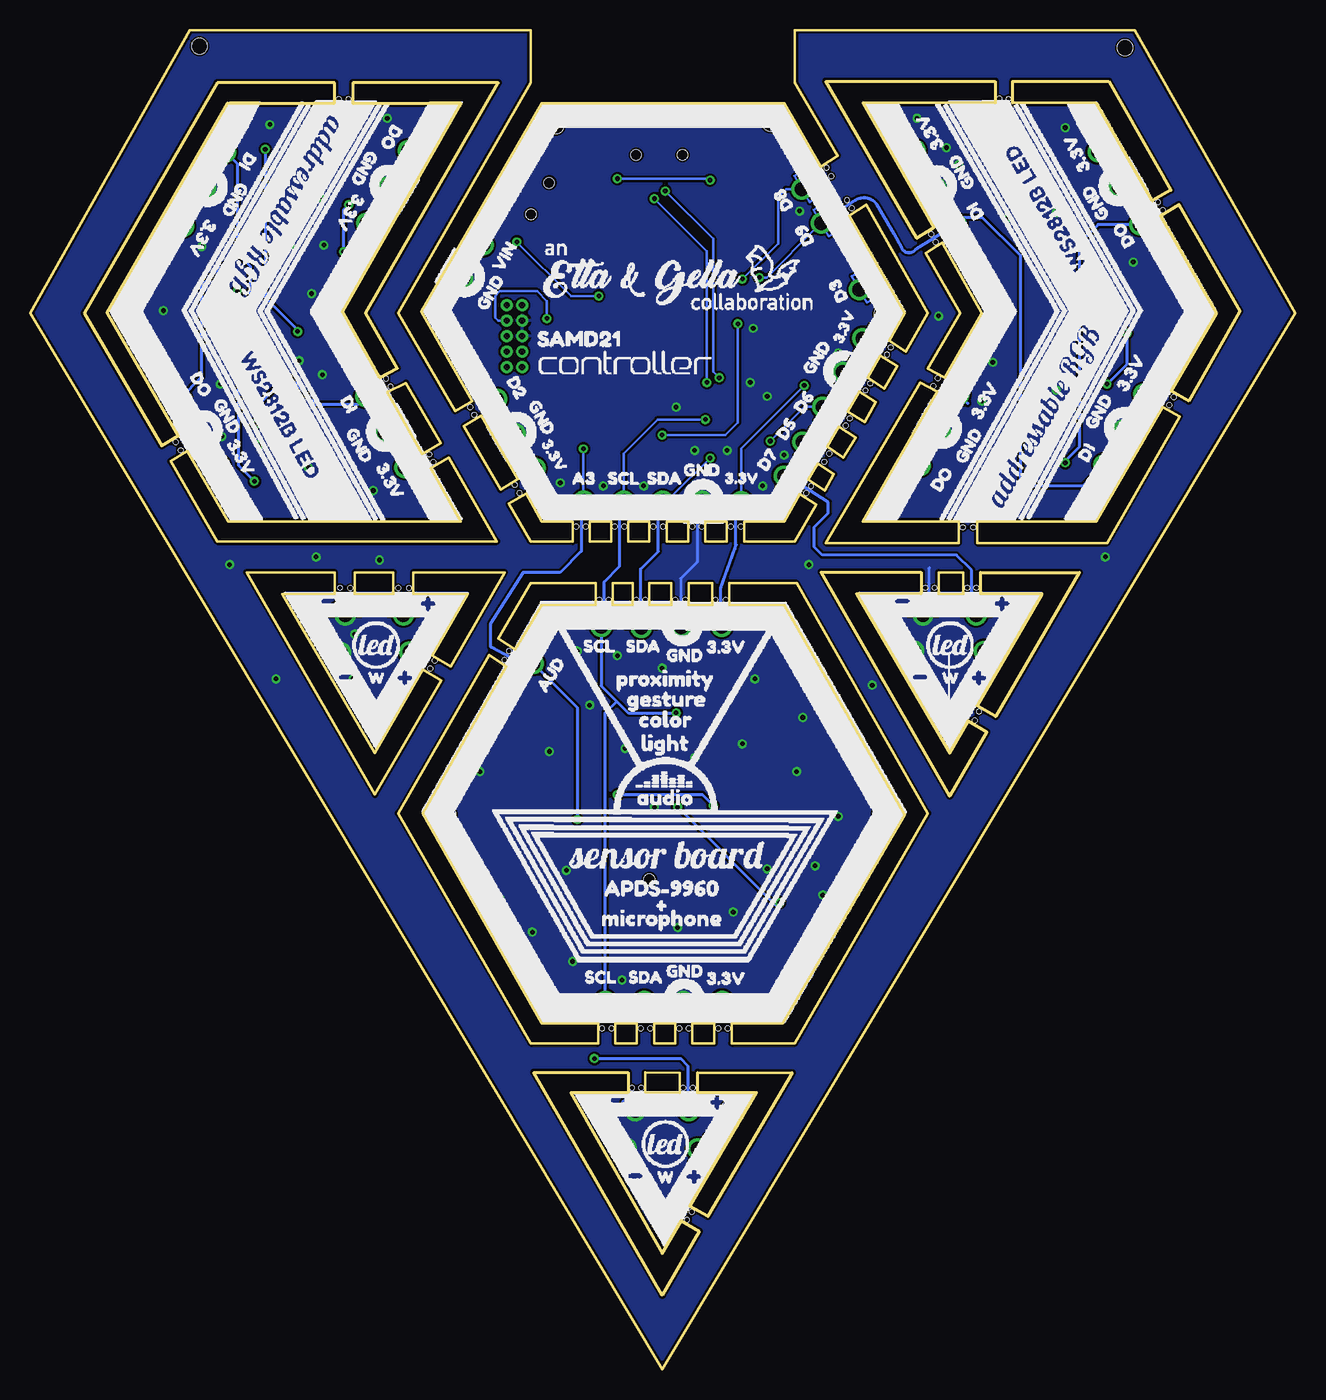
[diagram p4: board, bottom side, seen from below]

Size 104.01 x 110.11 mm. Coordinates in mm from the lower left corner, seen from the top.
Outline: 238 segments
Copper layers (1*16): Top 0.035mm / dielectric 1.5mm / Bottom 0.035mm
Design rules "SparkFun-2-layer-TIGHT": minimum track width 7mil, minimum drill 15mil, track to track 7mil, track to pad 7mil, pad to pad 7mil, via to via 7mil, smd to smd 7mil, copper to edge 7mil, drill to drill 7mil, minimum pad ring 7mil, minimum via ring 7mil, stop-mask expansion 4mil, vias tented up to drill 25mil, thermal gap 10mil
Holes 1.27 mm at 33.22,71.02 33.19,102.77 43.01,29.76 69.69,45.62 61.08,71.15 22.8,62.61 28.47,52.83 61.16,29.76 33.95,62.65 90.11,108.81 70.84,102.87 70.78,70.93 87.12,102.85 42.75,61.54 61.03,61.41 42.97,71.17 34,86.8 43.17,102.48 8.27,86.82 17.22,102.76 17.21,71.07 79.91,86.79 87.08,70.99 24.3,86.84 14.01,108.69 34.12,45.65 60.8,102.25 70.14,86.79 95.98,86.86 69.95,62.72 75.71,52.97 81.23,62.63 46.51,21.47 52.06,12.07 57.41,21.51
Holes 0.38 mm at 29.57,92.69 29.94,93.35 29.4,81.51 29.77,80.85 33.29,84.04 33.58,83.45 34.97,81.07 35.35,80.5 36.96,77.6 36.65,78.2 38.33,75.29 38.73,74.62 39.83,72.62 40.23,72.06 45.61,69.3 46.42,69.3 48.83,69.3 49.61,69.29 52.01,69.3 52.8,69.31 55.19,69.31 55.97,69.3 58.34,69.3 59.12,69.3 64.66,59.07 65.03,58.33 57.23,63.27 56.45,63.26 54.21,63.26 53.45,63.26 51.01,63.27 50.17,63.27 47.68,63.28 46.84,63.27 26.23,64.27 27.36,69.23 26.5,69.24 26.99,64.26 29.68,64.26 30.45,64.26 92.07,76.26 91.65,75.57 74.78,81.47 67.84,79.11 74.41,80.81 71.22,75.24 70.88,74.59 36.49,95.47 36.87,96.13 38.15,98.12 38.55,98.82 67.51,78.49 63.8,72.06 64.19,72.73 72.89,64.24 73.77,64.24 77.73,64.24 78.56,64.26 71.15,57.62 70.76,58.29 49.57,23.13 50.33,23.12 53.78,23.12 54.55,23.12 57.01,28.02 56.23,28.01 53.84,28.02 53.04,28.02 50.66,28.02 49.88,28.02 47.46,28.03 46.68,28.02 10.01,79.95 10.37,79.29 23.59,104.47 24.37,104.48 10.91,95.32 11.3,95.99 77.86,104.46 78.65,104.45 26.02,54.08 26.37,53.36 50.02,12.29 49.64,12.94

### Footprints (pad centres in the part's own frame; a part is rotated, then mirrored left to right if it is on the bottom)
0603 = smd 1.1 x 1: 1 -0.85,0; 2 0.85,0
0805 = smd 0.8 x 1.2: 1 -0.9,0; 2 0.9,0
LED-1206 = smd 1.2 x 1.4: A -1.5,0; C 1.5,0
WS2812B = smd 1.651 x 1: 1 2.577,-1.6; 2 2.577,1.6; 3 -2.577,1.6; 4 -2.577,-1.6
SOD-323 = smd 0.63 x 0.83: A 1.15,0; C -1.15,0
1X01 = drill 1.143: P$1 0,0
USB-AB-MICRO-SMD_V03 = smd 1.4 x 0.4: D+1 2.7,0; D-1 2.7,0.65; GND1 2.7,-1.3; ID1 2.7,-0.65; VBUS1 2.7,1.3 | smd 1.5 x 1.8: SHIELD1 0,3.68; SHIELD3 0,-3.68 | smd 1.5 x 2.5: SHIELD2 0,0 | hole 0.85: 2.2,1.9; 2.2,-1.9
2X5-PTH-1.27MM = drill 0.508 pad 1: 1 -2.54,-0.635; 2 -2.54,0.635; 3 -1.27,-0.635; 4 -1.27,0.635; 5 0,-0.635; 6 0,0.635; 7 1.27,-0.635; 8 1.27,0.635; 9 2.54,-0.635; 10 2.54,0.635
SOT23-3 = smd 0.8 x 0.9: 1 -0.95,-1; 2 0.95,-1; 3 0,1.1
0603-RES@1 = smd 1.1 x 1: 1 -0.85,0; 2 0.85,0
TACTILE_SWITCH_SMD_4.6X2.8MM = smd 0.9 x 1: 1 -2.05,-0.8; 2 2.05,-0.8; 3 2.05,0.8; 4 -2.05,0.8
SWITCH_DPDT_SMD_AYZ0202 = smd 1 x 1.15: 1 -2.5,2.825; 2 0,2.825; 3 2.5,2.825; 4 -2.5,-2.825; 5 0,-2.825; 6 2.5,-2.825 | hole 0.85: 1.5,0; -1.5,0
TQFP-48 = smd 1.5 x 0.28: 1 -4.25,2.75; 2 -4.25,2.25; 3 -4.25,1.75; 4 -4.25,1.25; 5 -4.25,0.75; 6 -4.25,0.25; 7 -4.25,-0.25; 8 -4.25,-0.75; 9 -4.25,-1.25; 10 -4.25,-1.75; 11 -4.25,-2.25; 12 -4.25,-2.75; 25 4.25,-2.75; 26 4.25,-2.25; 27 4.25,-1.75; 28 4.25,-1.25; 29 4.25,-0.75; 30 4.25,-0.25; 31 4.25,0.25; 32 4.25,0.75; 33 4.25,1.25; 34 4.25,1.75; 35 4.25,2.25; 36 4.25,2.75 | smd 0.28 x 1.5: 13 -2.75,-4.25; 14 -2.25,-4.25; 15 -1.75,-4.25; 16 -1.25,-4.25; 17 -0.75,-4.25; 18 -0.25,-4.25; 19 0.25,-4.25; 20 0.75,-4.25; 21 1.25,-4.25; 22 1.75,-4.25; 23 2.25,-4.25; 24 2.75,-4.25; 37 2.75,4.25; 38 2.25,4.25; 39 1.75,4.25; 40 1.25,4.25; 41 0.75,4.25; 42 0.25,4.25; 43 -0.25,4.25; 44 -0.75,4.25; 45 -1.25,4.25; 46 -1.75,4.25; 47 -2.25,4.25; 48 -2.75,4.25
SOT23-5 = smd 0.55 x 1.2: 1 -0.95,-1.3; 2 0,-1.3; 3 0.95,-1.3; 4 0.95,1.3; 5 -0.95,1.3
ADMP401 = smd 0.9 x 0.9: 1 -1.2,2.62; 5 1.2,2.62; 6 0,2.62 | smd 0.7 x 0.7: 2 1.3,-0.8; 4 -1.3,-0.8 | hole 0.9: 0,0
APDS-9960 = smd 0.6 x 0.72: 1 0.7,1.455; 2 0.7,0.485; 3 0.7,-0.485; 4 0.7,-1.455; 5 -0.7,-1.455; 6 -0.7,-0.485; 7 -0.7,0.485; 8 -0.7,1.455
CRYSTAL-SMD-3.2X1.5MM = smd 1 x 1.8: P$1 -1.25,0; P$2 1.25,0

### Placement (x,y rotation side)
C1  49.77,76.82 180 top
C2  55.55,84.05 0 top
C3  47.94,90.39 0 top
C4  40.91,83.96 270 top
C5  54.9,89.85 225 top
C6  53.12,91.59 45 top
C7  59.16,99.91 210 top
C8  47.97,33.63 0 top
C9  60.09,88.18 210 top
C10  50.34,94.89 90 top
C13  52.52,49.58 0 top
C15  46.85,57.64 180 top
C17  57.97,47.54 270 top
C18  56.88,42.05 90 top
C19  62.16,47.5 90 top
C20  45.69,47.99 180 top
C21  17.94,83.15 0 top
C22  23.62,102.55 180 top
C23  23.42,79.67 0 top
C24  80.2,102.3 180 top
C25  86.3,83.15 180 top
C26  81.22,79.69 180 top
D1  75.69,58.93 270 top
D2  80.42,98.76 0 top
D3  52.07,18.03 270 top
D4  28.45,58.93 270 top
D5  86.23,87 0 top
D6  81.15,76.14 0 top
D7  43.47,97.34 90 top
D8  56.51,93.96 30 top
D31  23.44,98.75 180 top
D32  17.91,86.9 180 top
D33  23.36,76.14 180 top
J3  40.5,76.27 120 top
J4  30.63,62.03 0 top
J5  42.05,73.47 120 top
J6  37.23,82 120 top
J7  73.24,74.16 60 top
J8  40.58,97.05 60 top
J9  39,94.25 60 top
J10  58.52,71.41 180 top
J11  48.8,71.4 180 top
J12  52.03,71.4 180 top
J13  56.74,30.27 180 top
J14  65.67,79.79 243 top
J15  57.09,61.06 0 top
J16  53.79,60.98 0 top
J17  47.17,61.07 0 top
J18  38.86,79.15 120 top
J19  50.49,61.02 0 top
J20  26.24,62.03 0 top
J23  35.87,88.8 60 top
J25  31.27,100.24 240 top
J26  15.75,74.37 120 top
J27  29.18,77.2 300 top
J28  47.14,30.27 180 top
J29  50.34,30.27 180 top
J32  27.88,94.17 240 top
J33  14.54,97.22 60 top
J34  16.24,100.11 60 top
J37  62.65,58.02 300 top
J38  55.23,71.41 180 top
J39  53.54,30.27 180 top
J41  12.79,94.13 60 top
J42  91.66,79.87 240 top
J43  29.57,97.22 240 top
J44  27.66,80.16 300 top
J45  12.48,80.19 120 top
J46  14.11,77.28 120 top
J47  76.35,94.27 120 top
J48  87.96,100.1 300 top
J49  89.59,97.17 300 top
J50  76.46,79.98 60 top
J51  74.6,97.27 120 top
J52  91.41,94.02 300 top
J53  72.97,100.22 120 top
J54  30.86,74.33 300 top
J55  74.88,77.01 60 top
J56  35.6,84.77 120 top
J57  88.46,74.28 240 top
J58  90,77 240 top
J59  78.48,58.93 240 top
J62  72.84,58.97 120 top
J63  78.13,62 0 top
J64  73.34,62.04 0 top
J65  54.28,21.25 0 top
J68  49.17,18.13 120 top
J69  55.02,18.18 240 top
J70  49.89,21.25 0 top
J71  66.78,92.46 300 top
J72  68.44,89.73 300 top
J73  45.57,71.37 180 top
J74  31.38,59.08 240 top
J75  64.15,76.94 240 top
J76  62.5,74.09 240 top
J77  25.59,59.05 120 top
JP3  52.3,102.07 270 top
JP5  64.22,84.96 270 top
Q1  58.98,90.13 300 top
R1  60.21,81.97 180 top
R2  28.45,54.99 180 top
R3  51.66,74.45 180 top
R4  55.38,95.37 30 top
R5  56.13,74.45 180 top
R6  45.3,97.34 90 top
R7  41.83,89.18 180 top
R9  45.69,44.32 180 top
R11  45.69,46.15 0 top
R12  60.07,47.5 90 top
R13  45.69,42.48 0 top
R15  75.69,54.99 180 top
R17  52.02,14.02 180 top
R29  49.04,53.18 90 top
S1  56.78,78.86 0 top
S2  62.11,96.28 300 top
S3  42.94,91.69 0 top
U1  47.11,83.83 270 top
U2  48.05,95.07 180 top
U5  52.93,46.32 90 top
U6  53.12,40.27 0 top
U7  52.98,53.58 0 top
U$2  [HACKMODWEAR_V2SILK_DRAFT_BUZZARDTOP#01#JPG]  52.12,54.97 0 top
U$3  [HACKMODWEAR_V2SILK_DRAFT_BUZZARDBOTTOM#01#JPG]  51.87,54.98 0 top
Y1  52.14,88.82 315 top

### Tracks (layer width: path | path; a pad name or v marks a point on that pad's centre or on a via)
3.3V  (via drill 0.38)
  Top 0.203: C10.1 50.34,92.75 50.17,92.58 49.02,92.58 | C3.1 47.09,90.3 47.09,89.56 47.36,89.29 U1.6 47.36,84.58 47.37,84.58 | C4.1 41.15,84.58 U1.17 47.37,84.58 | C4.1 40.91,89.11 R7.2 | U1.36 49.86,78.79 50.62,78.03 C1.1 50.81,76.63 50.81,75.44 | 50.81,75.44 R3.2 48.67,74.45 45.59,71.37 J73.P$1 | J76.P$1 62.33,74.27 62.2,74.27 62.02,74.09 57.34,74.09 R5.1 55.99,75.44 50.81,75.44 | 59.31,85.09 53.59,85.09 53.08,84.58 U1.44 47.37,84.58 | 59.31,85.09 61.17,85.09 JP5.1 | C4.1 38.99,84.81 | 38.99,84.81 36.04,84.81 35.91,84.95 35.78,84.95 J56.P$1 | R1.2 59.36,85.04 59.31,85.09 | 46.91,92.25 47.24,92.58 49.02,92.58 | U2.5 49,92.61 49.02,92.58 | 38.99,84.81 38.99,82.3 v40.39,80.9
  Top 0.254: 17.4,100.35 D31.1 23.52,100.35 24.38,101.22 24.38,102.46 C22.1 28.96,102.55 J25.P$1 | 17.4,100.35 16.48,100.35 J34.P$1 | 17.4,100.35 17.4,88.9 17,88.5 D32.1 13.44,88.5 12.7,87.76 12.7,83.82 14.54,81.98 | J45.P$1 12.75,80.19 14.54,81.98 | 14.54,81.98 15.72,83.15 C21.1 17.09,79.81 19.18,77.72 20.77,77.72 D33.1 22.34,77.74 22.35,77.72 22.58,77.95 C23.1 22.61,79.7 22.61,80.52 23.24,81.15 26.55,81.15 26.82,80.89 26.93,80.89 J44.P$1 30.73,81.79 32.26,83.06 34.54,84.33 J56.P$1 | 49.04,55.12 R29.2 44.12,54.03 42.42,52.32 42.42,44.2 | 49.04,55.12 49.04,55.35 47.7,56.7 C15.1 47.7,60.53 J17.P$1 | U7.8 49.12,55.04 49.04,55.12 | 42.42,44.2 44.72,44.2 R9.2 | v50.8,46.23 50.8,46.2 50.67,46.07 50.67,45.47 50.77,45.37 U5.5 | U6.5 55.5,42.89 | 55.5,42.89 56.86,42.89 C18.2 | 42.42,44.2 v42.42,38.35 42.42,34.76 43.55,33.63 44.72,33.63 | 55.5,42.89 55.5,36.7 53.59,34.8 44.96,34.8 44.72,34.56 44.72,33.63 | 47.05,30.17 J28.P$1 47.14,33.6 C8.1 44.72,33.63 | J76.P$1 62.5,73.71 63.59,72.62 65.29,71.66 65.91,71.87 66.67,72.14 68.96,75.44 69.56,75.64 71.92,74.49 J7.P$1 75.56,74.16 77.47,76.07 82.07,76.07 | J57.P$1 88.21,74.54 D6.1 82.69,74.54 82.07,75.16 82.07,76.07 | 82.07,76.07 C26.1 82.13,79.63 86.23,79.63 87.15,80.54 87.15,83.06 | C25.1 87.15,83.06 | 87.15,83.06 87.12,83.08 87.12,84.84 87.68,85.4 D5.1 90.5,85.4 90.55,85.34 91.41,86.2 J52.P$1 91.15,94.27 85.47,94.27 | C24.1 81.05,98.02 81.92,97.16 D2.1 | D2.1 | J47.P$1 85.47,94.27 | D2.1 83.12,97.03 84.58,97.03 85.47,96.14 85.47,94.27
  Top 0.305: D7.A 43.47,94.71 44.47,93.71 45.45,93.71 46.91,92.25 47.12,92.04 47.12,90.32 47.09,90.3
  Bottom 0.203: v40.39,80.9 45.57,75.71 J73.P$1
  Bottom 0.254: J44.P$1 26.92,79.42 | J17.P$1 47.24,62.87 47.24,64.26 46.1,67.44 45.97,67.82 arc90 46.01,67.85 46.01,70.94 J73.P$1 | v50.8,46.23 42.8,38.23 42.29,38.23 42.42,38.1 v42.42,38.35
!RESET
  Top 0.203: 58.93,79.66 60.36,79.66 60.96,80.26 60.96,81.88 R1.1 61.13,82.04 61.98,82.04 62.48,81.53 64.64,81.53 64.86,81.75 JP5.10 | 58.93,79.66 S1.3 | S1.4 56.64,79.66 | 56.64,79.66 58.93,79.66 | U1.40 54.96,82.58 56.64,80.9 56.64,79.66
A3  (via drill 0.38)
  Top 0.203: U1.9 45.86,86 v45.85,85.98 | v58.55,75.69 58.04,76.2 52.7,76.2 v52.07,76.84
  Top 0.254: v59.06,45.21 58.04,45.21 | 58.04,45.21 55.12,45.21 54.96,45.37 U5.1 53.5,45.37 52.83,44.7 51.44,44.7 48.01,41.27 45.34,41.27 44.84,41.77 R13.1 | C17.2 57.97,45.28 58.04,45.21
  Bottom 0.203: v45.85,85.98 45.85,77.85 46.86,76.84 v52.07,76.84 | v58.55,75.69 58.55,71.77 58.52,71.74 J10.P$1
  Bottom 0.254: J10.P$1 58.52,71.37 58.52,70.01 58.71,69.82 58.71,67.27 60.45,65.53 63.5,65.53 66.17,61.34 66.17,59.45 arc-90 66.08,59.37 64.55,58.54 63.16,58.54 J37.P$1 59.06,54.43 v59.06,45.21 | v59.06,45.21 59.06,45.09 v59.06,45.21
D2  (via drill 0.38)
  Top 0.203: U1.23 43.96,81.58 44.8,82.42 49.05,82.42 49.75,81.72 49.75,81.4 54.32,76.84 60.58,76.84 64.01,80.26 65.19,80.26 J14.P$1
  Top 0.254: J14.P$1 69.15,78.07 69.94,78.07 71.25,79.38 75.2,86.47 64.36,106.12 64.18,106.49 77.78,106.49 78.27,105.91 78.24,103.46 75.06,99.44 | J53.P$1 74.28,100.22 75.06,99.44 | 75.06,99.44 77.34,97.16 D2.4 v77.85,95.76 | v87.93,90.64 79.61,90.64 78.26,91.99 v78.26,91.9
  Bottom 0.254: J42.P$1 89.91,81.62 89.91,89.1 88.39,90.62 87.95,90.62 v87.93,90.64 | v78.26,91.9 78.26,95.35 v77.85,95.76
D3
  Top 0.203: J23.P$1 37.97,90.89 S3.1 42.67,90.89 | 42.67,90.89 S3.2 | 42.67,90.89 42.68,90.88 R7.1 42.68,88.66 41.66,87.63 41.66,86.23 41.81,86.08 U1.14
D5
  Top 0.203: U1.24 41.84,81.08 40.5,79.74 40.5,76.98 40.81,76.45 40.68,76.45 J3.P$1
D6  (via drill 0.38)
  Top 0.203: U1.29 46.36,79.57 46.36,78.1 44.58,76.33 v43.18,76.33
  Bottom 0.203: v43.18,76.33 40.36,79.15 39.35,79.15 39.17,79.32 38.99,79.15 J18.P$1
D7  (via drill 0.38)
  Top 0.203: U1.30 46.86,77.73 42.61,73.47 42.53,73.47 42.36,73.65 42.23,73.65 J5.P$1
  Top 0.254: J5.P$1 40.25,72.48 38.5,71.37 38.5,70.12 | 26.51,59.97 26.97,60.43 D4.A | 26.51,59.97 25.92,59.38 25.92,59.24 25.78,59.24 J77.P$1 | 26.51,59.97 26.24,60.25 J20.P$1 26.24,62.43 26.63,62.82 | J70.P$1 49.97,21.34 51.44,21.34 52.07,20.7 D3.A 50.57,19.53 49.5,18.46 49.5,18.32 49.31,18.13 J68.P$1 | J64.P$1 73.66,62.36 75.06,62.36 75.69,61.72 D1.A | J64.P$1 73.34,59.47 73.17,59.3 73.17,59.16 72.98,58.97 J62.P$1 69.47,57.09 69.16,56.29 74.89,46.26 74.9,45.04 63.97,25.72 63.81,25.45 57.73,25.52 57.71,25.55 v57.64,25.55 | 38.48,70.11 38.5,70.12 | J64.P$1 73.31,62.07 arc2 73.31,66.03 72.88,66.47 42.15,66.47 38.5,70.12
  Bottom 0.254: J5.P$1 40.29,72.5 38.48,71.37 38.43,71.31 38.43,70.4 39.55,69.28 39.55,67.61 38.9,66.96 27.88,66.96 26.63,65.71 26.63,62.42 J20.P$1 | v57.64,25.55 50.56,25.55 49.93,24.92 49.93,21.29 J70.P$1
D8  (via drill 0.38)
  Top 0.203: U1.11 44.86,89.06 v45.47,89.66
  Bottom 0.203: v45.47,89.66 42.55,92.58 42.55,96.39 41.88,97.05 41.07,97.05 40.89,96.88 40.71,97.05 J8.P$1
D9  (via drill 0.38)
  Top 0.203: U1.12 44.36,89.49 v44.07,89.79
  Top 0.254: D31.4 25.87,100.2 24.38,100.2 23.5,99.31 23.5,96.39 25.72,94.17 J32.P$1 27.74,94.17
  Bottom 0.203: v44.07,89.79 43.46,89.79 39.3,93.94 39.3,94.07 39.13,94.25 J9.P$1
  Bottom 0.254: J26.P$1 17.48,72.64 21.97,72.64 22.61,73.28 22.61,91.57 25.78,94.74 27.3,94.74 J32.P$1 31.24,92.07 arc112 32.38,92.2 arc-4 34.42,95.76 arc-92 36.2,96.14 J9.P$1
DO  (via drill 0.38)
  Top 0.254: D33.2 20.78,74.42 | 20.78,74.42 20.78,73.46 21.59,72.64 29.34,72.64 30.86,74.16 J54.P$1 | v18.92,74.55 19.05,74.42 20.78,74.42
  Bottom 0.254: J41.P$1 16.23,94.13 17.78,92.58 17.78,75.82 18.92,74.68 v18.92,74.55
DOUT  (via drill 0.38)
  Top 0.254: D6.2 85.49,77.74 85.52,77.7 v85.5,77.72 v85.49,77.72
  Bottom 0.254: J48.P$1 87,99.14 87,91.76 85.95,90.72 85.95,84.78 82.87,81.7 | 82.87,81.7 80.55,79.38 77.06,79.38 J50.P$1 | v85.49,77.72 85.49,79.08 82.87,81.7
GND  (via drill 0.38)
  Top 0.203: U1.5 47.88,88.09 47.88,89.03 48.39,89.53 48.64,89.53 48.79,89.69 C3.2 | U1.18 41.88,84.08 C4.2 | U1.35 49.36,77.94 48.92,77.49 C1.2
  Top 0.254: J46.P$1 15.94,77.28 17.4,75.82 17.4,73.41 19.3,71.5 25.53,71.5 26.92,70.1 26.92,67.06 27.94,66.04 29.34,66.04 30.1,65.28 30.1,63.12 30.63,62.59 J4.P$1 | 50.55,60.96 J19.P$1 | J29.P$1 50.3,30.22 50.3,26.61 51.72,25.19 53.45,25.19 54.16,24.48 54.16,21.38 J65.P$1 | J63.P$1 78.13,65.73 78.17,65.77 | J58.P$1 93.53,74.76
  Bottom 0.254: J4.P$1 30.1,62.56 30.1,65.91 | J11.P$1 48.8,70.26 49.2,69.86 49.2,66.39 50.56,65.04 50.56,61.09 J19.P$1
  other vias: 19.69,80.52 24.89,82.8 24,74.93 25.78,79.63 20.07,91.19 13.34,91.06 25.78,90.3 27.69,99.06 19.69,95.12 23.75,94.62 28.7,100.46 31.12,102.87 18.92,102.11 67.06,49.15 61.34,50.8 58.04,54.61 59.06,59.05 55.75,58.67 52.07,57.66 44.45,56.77 40.51,53.59 41.02,49.15 37.59,45.47 39.5,41.4 38.86,38.99 46.23,37.59 59.94,41.02 55.12,51.05 49.4,50.29 45.47,51.44 43.43,41.15 50.8,36.32 55.37,32 59.44,33.53 62.74,35.94 65.41,38.73 67.69,41.66 24.26,60.96 75.82,72.26 81.15,74.17 80.01,81.79 88.39,81.03 88.27,76.71 85.09,76.07 92.71,82.68 81.92,82.93 80.89,88.46 79.88,92.46 82.68,92.46 89.92,92.33 93.07,87.06 80.26,96.39 74.68,102.87 84.33,102.36 79.5,98.81 70.87,61.21 77.34,60.45 77.47,56.77 75.31,66.55 80.52,66.8 87.63,66.17 83.82,56.77 34.8,56.26 40.01,66.17 15.62,66.8 29.34,86.61 37.59,83.57 43.43,80.01 43.81,72.64 46.74,75.56 42.04,75.18 50.93,79.12 53.59,72.64 56.9,72.64 60.45,72.9 40.77,95.25 44.83,81.15 44.58,85.6 49.4,75.56 52.7,46.23
  pour Top: 13.28,110.12 90.6,110.12 104.01,86.9 52,1.1 -0.15,86.86
  pour Bottom: 13.21,110.11 90.93,110.11 104.01,86.87 52.07,0 0,86.87
IN  (via drill 0.38)
  Top 0.203: U2.1 49,97.69 48.89,97.79 48.77,97.79 | 48.77,97.79 v48.13,97.79 | v48.13,97.79 47.37,97.79 47.1,97.52 U2.3 | C7.1 59.15,101.09 57.53,101.09 55.75,99.31 v55.75,97.92 | v48.13,97.79 48.77,97.79
  Top 0.254: C7.1 60.4,100.84 60.96,100.84 63.25,97.41 63.88,97.16 S2.2
  Bottom 0.203: v55.75,97.92 48.26,97.92 v48.13,97.79
LEDA
  Top 0.254: U7.5 51.05,52.12 | 51.05,52.12 49.24,52.12 R29.1 | C13.1 51.62,50.74 51.05,51.31 51.05,52.12
N$1
  Top 0.254: D4.C 28.45,56.39 27.6,55.54 R2.2
N$2
  Top 0.203: U1.1 49.86,87.17 49.91,87.12 52.21,87.12 Y1.P$2 54.3,89.21 C5.2
N$3
  Top 0.254: C19.1 62.16,45.01 61.34,44.2 52.58,44.2 51.92,43.54 U6.1
N$4
  Top 0.203: U1.2 49.36,89.37 50.17,90.17 50.79,90.17 Y1.P$1 52.51,90.96 C6.1
N$5
  Top 0.254: U7.3 U7.4
N$6
  Top 0.254: R13.2 47.69,42.48 49.4,44.2 49.4,46.1 50.57,47.27 U5.4 51.65,47.24 52.7,47.24 53.86,48.4 57.66,48.4 | C17.1 57.66,48.4 | R12.1 59.27,46.65 58.93,46.99 58.93,48.13 58.67,48.4 57.66,48.4
N$7
  Top 0.254: R6.2 45.3,99.73 44.83,100.2 43.81,100.2 43.43,99.82 43.43,98.87 D7.C
N$8  (via drill 0.38)
  Top 0.203: S2.3 64.14,93.85 64.14,92.71 v64.01,92.71 | Q1.2 57.82,88.81 v57.28,88.26 56.64,88.9 56.64,92.26 D8.C
  Bottom 0.203: v64.01,92.71 59.56,88.26 v57.28,88.26
N$10
  Top 0.254: R12.2 C19.2
N$11  (via drill 0.38)
  Top 0.254: C20.1 47.64,47.99 47.88,47.75 47.88,46.86 | 47.88,46.86 v47.88,46.36 | v47.88,46.36 47.88,44.7 47.49,44.32 R9.1 | R11.2 46.74,46.36 v47.88,46.36 | U5.3 55.73,47.27 v55.75,47.24 | v47.88,46.36 47.88,46.86
  Bottom 0.254: v55.75,47.24 48.77,47.24 v47.88,46.36
N$12
  Top 0.254: D1.C 74.8,56.54 74.8,55.03 R15.2
N$14
  Top 0.254: D32.4 22.08,88.5 22.73,89.15 22.73,96.77 22.36,97.15 D31.2
N$15
  Top 0.254: D3.C 51.17,15.64 R17.2
N$16  (via drill 0.38)
  Top 0.254: D33.4 24.52,77.74 22.99,76.2 19.05,76.2 15.49,79.76 v15.49,81.03 | v13.84,85.22 15.25,85.22 D32.2
  Bottom 0.254: v15.49,81.03 13.84,82.68 v13.84,85.22 | v13.84,85.22 13.84,85.34 v13.84,85.22
N$22  (via drill 0.38)
  Top 0.254: D2.2 84.68,100.35 v84.71,100.33 | v82.04,85.34 83.61,85.34 D5.4
  Bottom 0.254: v84.71,100.33 84.71,88.14 82.04,85.47 v82.04,85.34
N$23  (via drill 0.38)
  Top 0.254: D6.4 80.21,72.9 85.47,72.9 v85.6,73.03 | v87,88.65 88.76,88.65 D5.2
  Bottom 0.254: v85.6,73.03 86.87,74.29 86.87,88.39 87,88.52 v87,88.65
SCL  (via drill 0.38)
  Top 0.203: U1.32 47.88,79.56 47.88,78.36 48.13,78.1 v48.51,78.1 | R5.2 55.28,71.46 J38.P$1
  Top 0.254: v50.93,53.98 52.19,53.98 U7.7
  Bottom 0.203: v48.51,78.1 52.45,78.1 55.25,75.31 55.25,71.78 | 55.25,71.78 55.23,71.76 | J38.P$1 55.25,71.43 55.25,71.78
  Bottom 0.254: J38.P$1 55.57,71.06 55.57,66.04 56.85,64.76 56.85,62.86 57.09,62.63 J15.P$1 57.09,56.2 55.82,54.93 | 55.82,54.93 54.86,53.98 v50.93,53.98 | J13.P$1 56.74,54 55.82,54.93
SDA  (via drill 0.38)
  Top 0.203: U1.31 47.36,78.11 47.75,77.72 47.75,75.31 v48.13,74.93 | R3.1 52.51,73.08 51.94,72.52 51.94,71.48 J12.P$1
  Top 0.254: U7.1 54.4,55.04 54.61,55.24 54.61,56.9 | 54.61,56.9 54.61,58.55 54.61,60.16 J16.P$1 | 54.61,56.9 58.93,56.9 64.01,51.82 64.01,42.16 53.54,31.7 J39.P$1
  Bottom 0.203: v48.13,74.93 51.31,71.75 52.03,71.75 J12.P$1
  Bottom 0.254: J16.P$1 53.8,62.82 53.84,62.87 53.84,65.81 52.39,67.26 52.39,71.03 J12.P$1
SWCLK  (via drill 0.38)
  Top 0.203: U1.45 51.38,85.09 53.06,85.09 53.44,85.47 60.45,85.47 61.34,86.36 61.5,86.36 v61.55,86.41
  Bottom 0.203: v61.55,86.41 61.55,87.83 62.36,88.65 65.41,88.65 65.79,88.26 65.79,86.49 65.53,86.23 JP5.4
SWDIO
  Top 0.203: U1.46 53,85.58 53.28,85.85 60.07,85.85 62.5,88.28 64.63,88.28 64.86,88.05 JP5.2
USB_D+  (via drill 0.38)
  Top 0.203: JP3.D+1 52.3,97.39 v51.82,96.9 | v47.37,81.53 47.88,82.04 48.89,82.04 49.15,81.79 49.15,80.77 48.86,80.49 U1.34
  Bottom 0.203: v51.82,96.9 47.88,92.96 47.88,82.04 v47.37,81.53
USB_D-  (via drill 0.38)
  Top 0.203: v48.39,81.15 48.39,79.6 U1.33 | JP3.D-1 52.95,97.54 53.47,97.03 53.47,95.63 53.21,95.38 52.2,95.38 52.07,95.5 52.07,96.14 52.2,96.27 v52.7,96.27
  Bottom 0.203: v52.7,96.27 48.39,91.95 v48.39,81.15
VBUS
  Top 0.305: JP3.VBUS1 53.6,98.31 R4.2 57.38,94.53 D8.A 57.51,90.59 Q1.1
VDDCORE
  Top 0.203: U1.43 54.67,84.08 C2.1
VIN
  Top 0.203: C9.1 62.99,90.77 62.99,91.44 63.12,91.57
  Top 0.254: Q1.3 60.2,90.68 61.09,91.57 63.12,91.57 63.63,91.57 65.89,91.57 J71.P$1

### Text on the board
tPlace: https://creativecommons.org/licenses/by-nc-sa/4.0/legalcode / / This license lets others remix, tweak, and build upon your work non-commercially, and / although their new works must also acknowledge you and be non-commercial, they / don’t have to license their derivativeworks on the same terms. | Drawn by Mary Etta West